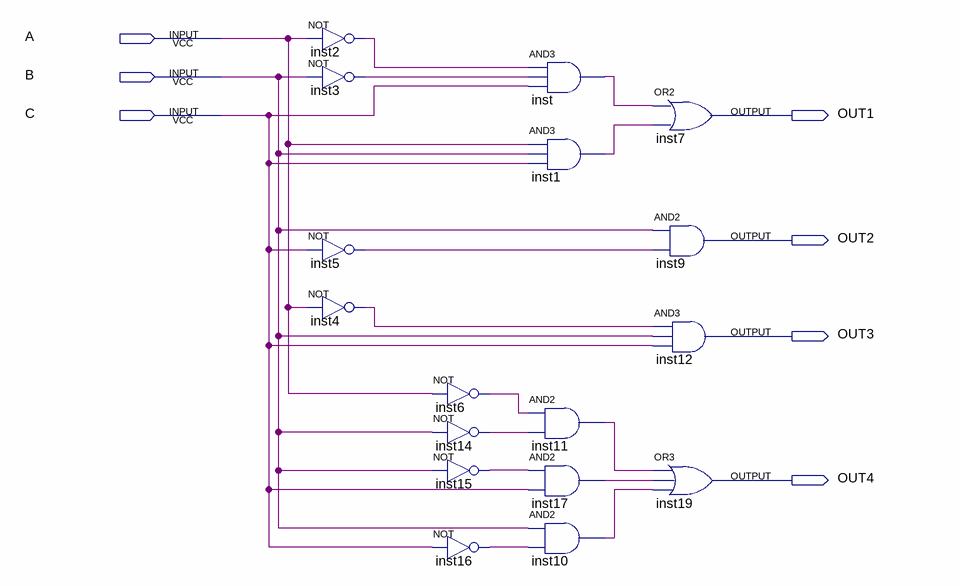
[diagram p0: schematic sheet]
// Quartus schematic Lab_02.bdf as structural Verilog: 17 symbols, 7 pins
module Lab_02 (
  input  A,
  input  B,
  input  C,
  output OUT1,
  output OUT2,
  output OUT3,
  output OUT4
);

  wire inst1_out, inst2_out, inst3_out, inst4_out, inst5_out, inst6_out, inst10_out, inst11_out, inst14_out,
       inst15_out, inst16_out, inst17_out, inst_out;

  not inst2 (inst2_out, A);
  not inst3 (inst3_out, B);
  not inst5 (inst5_out, C);
  not inst4 (inst4_out, A);
  not inst6 (inst6_out, A);
  not inst14 (inst14_out, B);
  not inst15 (inst15_out, B);
  not inst16 (inst16_out, C);
  and inst (inst_out, inst2_out, inst3_out, C);
  and inst1 (inst1_out, A, B, C);
  and inst11 (inst11_out, inst6_out, inst14_out);
  and inst17 (inst17_out, inst15_out, C);
  and inst10 (inst10_out, B, inst16_out);
  or inst7 (OUT1, inst_out, inst1_out);
  and inst9 (OUT2, B, inst5_out);
  and inst12 (OUT3, inst4_out, B, C);
  or inst19 (OUT4, inst11_out, inst17_out, inst10_out);
endmodule
